# EAGLE board flex_conn_v5 (EAGLE 6.6.0), part 1 of 2
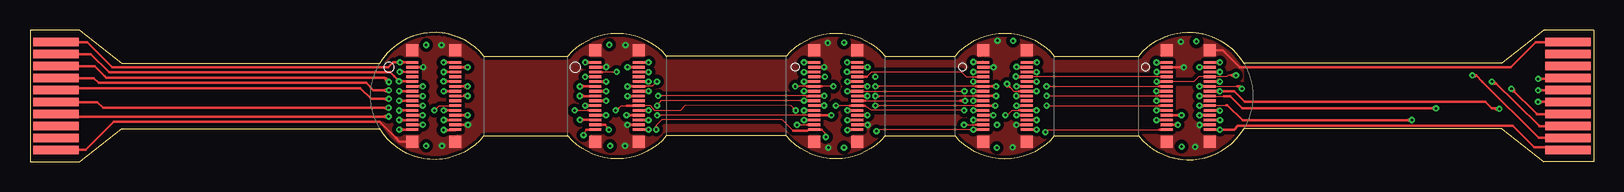
[diagram p1: board, top side]
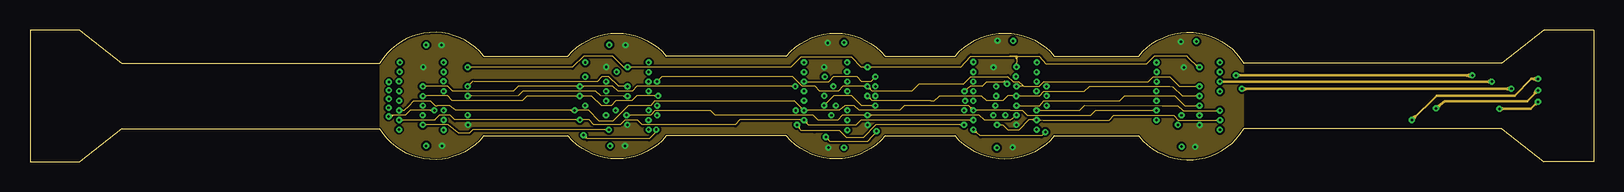
[diagram p2: board, inner layer Route2]
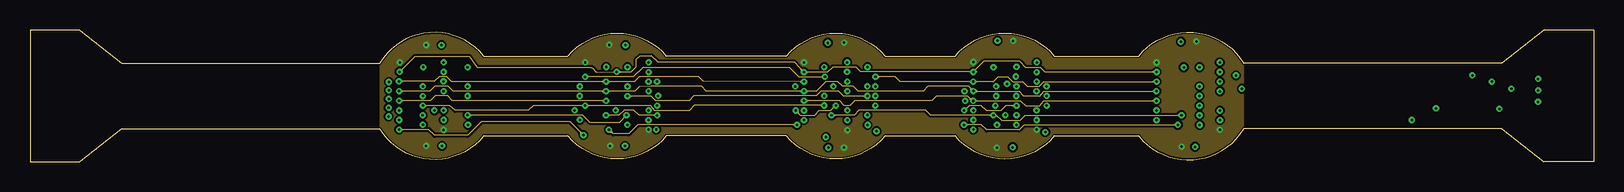
[diagram p3: board, inner layer Route15]
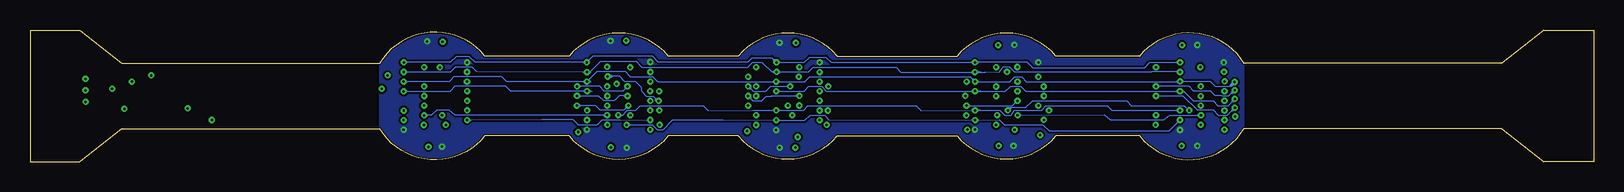
[diagram p4: board, bottom side, seen from below]

Size 130.3 x 11 mm. Coordinates in mm from the lower left corner, seen from the top.
Outline: 126.15,0 130.3,0 130.3,11 126.15,11 122.65,8.23 101.15,8.23 arc110 92.39,8.83 85.37,8.83 arc100 77.1,8.83 71.26,8.83 arc100 63.04,8.83 53.04,8.83 arc100 44.81,8.83 37.81,8.83 arc110 29.15,8.23 7.65,8.23 4.15,11 0,11 0,0 4.15,0 7.65,2.77 29.15,2.77 arc110 37.81,2.17 44.81,2.17 arc100 53.04,2.17 63.04,2.17 arc100 71.26,2.17 77.1,2.17 arc100 85.37,2.17 92.39,2.17 arc110 101.15,2.77 122.65,2.77 126.15,0
Copper layers (1*2*15*16): Top 0.035mm / dielectric 0.2mm / Route2 0.035mm / dielectric 0.2mm / Route15 0.035mm / dielectric 0.2mm / Bottom 0.035mm
Design rules "default": minimum track width 0.1mm, minimum drill 8mil, track to track 3.5mil, track to pad 3.5mil, pad to pad 3.5mil, via to via 3.5mil, smd to smd 0mil, copper to edge 0.15mm, drill to drill 0.25mm, minimum pad ring 6mil, minimum via ring 6mil, stop-mask expansion 1.5mil, vias tented up to drill 25mil, thermal gap 10mil

## Footprints (pad centres in the part's own frame; a part is rotated, then mirrored left to right if it is on the bottom)
500913-0302_REC_30CONN_2 = smd 1 x 0.22: P$1 -1.8,2.8; P$2 -1.8,2.4; P$3 -1.8,2; P$4 -1.8,1.6; P$5 -1.8,1.2; P$6 -1.8,0.8; P$7 -1.8,0.4; P$8 -1.8,0; P$9 -1.8,-0.4; P$10 -1.8,-0.8; P$11 -1.8,-1.2; P$12 -1.8,-1.6; P$13 -1.8,-2; P$14 -1.8,-2.4; P$15 -1.8,-2.8; P$16 1.8,-2.8; P$17 1.8,-2.4; P$18 1.8,-2; P$19 1.8,-1.6; P$20 1.8,-1.2; P$21 1.8,-0.8; P$22 1.8,-0.4; P$23 1.8,0; P$24 1.8,0.4; P$25 1.8,0.8; P$26 1.8,1.2; P$27 1.8,1.6; P$28 1.8,2; P$29 1.8,2.4; P$30 1.8,2.8 | smd 1 x 1: P$31 1.8,3.8; P$32 -1.8,3.8; P$33 -1.8,-3.8; P$34 1.8,-3.8
FPC_FFC = smd 3.8 x 0.7: P$1 0,4.5; P$2 0,3.5; P$3 0,2.5; P$4 0,1.5; P$5 0,0.5; P$6 0,-0.5; P$7 0,-1.5; P$8 0,-2.5; P$9 0,-3.5; P$10 0,-4.5

## Placement (x,y rotation side)
U$1  500913-0302_REC_30CONN_2  [500913-0302_REC_30CONN_2]  81.24,5.5 0 top
U$2  500913-0302_REC_30CONN_2  [500913-0302_REC_30CONN_2]  48.91,5.5 0 top
U$3  500913-0302_REC_30CONN_2  [500913-0302_REC_30CONN_2]  33.66,5.5 0 top
U$4  500913-0302_REC_30CONN_2  [500913-0302_REC_30CONN_2]  96.51,5.5 0 top
U$5  CABLE_ADAPTATOR  [FPC_FFC]  2.15,5.5 0 top
U$6  500913-0302_REC_30CONN_2  [500913-0302_REC_30CONN_2]  67.15,5.5 0 top
U$7  CABLE_ADAPTATOR  [FPC_FFC]  128.15,5.5 0 top

## Tracks (layer width: path | path; a pad name or v marks a point on that pad's centre or on a via)
/CS_0
  Top 0.1: 69.73,7.1 70.15,7.51 77.61,7.51 78.01,7.11 U$1.P$4
  Top 0.18: 78.8,7.1 79.04,7.1
  Top 0.2: U$6.P$27 69.73,7.1 | 79.04,7.1 U$1.P$4
/CS_1  (via drill 0.2)
  Top 0.1: 94.73,7.11 U$4.P$4 83.04,7.1 83.01,7.11 | U$6.P$22 68.97,5.08 68.97,5.1 v77.92,5.1 | 82.55,7.1 82.19,7.1 v82.16,7.13
  Top 0.15: 77.5,5.12 77.84,5.25 77.89,5.25 77.9,4.99 | 77.9,4.99 77.87,4.92 77.5,5.09 | 77.9,4.99 77.9,5.08 v77.92,5.1
  Top 0.2: 83.01,7.11 82.14,7.11 v82.16,7.13 v82.16,7.14 82.16,7.25 82.52,7.11 | 69.59,5.09 U$6.P$22 | 82.19,6.98 82.55,7.1
  Bottom 0.1: v77.92,5.1 77.98,5.09 78.38,5.5 78.94,5.5 79.37,5.92 79.37,6.24 79.82,6.7 80.72,6.7 81.15,7.13 v82.16,7.13 | 81.79,7.15 81.79,7.14 | 78.14,5.24 78.06,5.24 v77.92,5.1 | 77.9,5.25 77.9,5.12 v77.92,5.1
  Bottom 0.15: 81.79,7.15 82.1,7.29 82.1,7.18 82.14,7.14 82.14,7.08 82.1,7.04 82.1,7.06 v82.16,7.13 | 78.03,5.05 78.09,5.03 | 78.09,5.03 78.14,5.24 | 77.98,5.09 78.08,5.09 78.09,5.03 | 81.79,7.14 82.1,6.96 | 77.92,5.28 78.14,5.24 | 77.9,5.25 78.06,4.99
/CS_2  (via drill 0.2)
  Top 0.1: v66.24,7.1 U$6.P$4 | U$2.P$4 v46.27,7.09
  Route15 0.1: v66.24,7.1 v66.23,7.1 64.07,7.1 63.28,7.89 51.09,7.89 50.29,7.09 v46.27,7.09 v46.26,7.09
/RST_BUS  (via drill 0.2 pad 0.51)
  Top 0.1: U$1.P$21 82.79,4.7 | v82.21,4.7 | 68.7,4.7 U$6.P$21 68.71,4.7 | 69.57,4.7 70.15,4.3 v77.85,4.3 | v63.81,4.29 63.44,4.7 54.6,4.72 54.19,4.29 52.07,4.29 | 68.31,4.7 v67.15,4.7 | 77.71,4.15 77.55,4.3 | v77.85,4.3 77.71,4.15 | 77.71,4.45 77.55,4.3 | v77.85,4.3 77.71,4.45 | 77.71,4.15 77.55,4.3 | v77.85,4.3 77.71,4.15 | 77.71,4.45 77.55,4.3 | v77.85,4.3 77.71,4.45 | 77.55,4.3 77.71,4.15 v77.85,4.3 | 77.71,4.45 77.55,4.3 | v77.85,4.3 77.71,4.45 | 67.29,4.85 67.46,4.7 | v67.15,4.7 67.29,4.85 | 67.29,4.55 67.46,4.7 | v67.15,4.7 67.29,4.55 | 67.46,4.7 67.29,4.85 v67.15,4.7 | 67.29,4.55 67.46,4.7 | v67.15,4.7 67.29,4.55 | 67.29,4.85 67.46,4.7 | v67.15,4.7 67.29,4.85 | 67.46,4.7 67.29,4.55 v67.15,4.7 | 63.61,4.52 63.83,4.5 v63.81,4.29 | 63.61,4.52 63.61,4.29 v63.81,4.29 | 63.61,4.52 63.83,4.5 v63.81,4.29 | U$3.P$21 U$3.P$21 arc90 U$3.P$21 34.35,4.7 34.1,4.7 v33.7,4.3 | 48.8,4.49 49.09,4.51 49,4.25 v48.8,4.3 | v48.8,4.3 48.8,4.5 | v48.8,4.3 v48.81,4.3 48.87,4.3 49.08,4.51 49.26,4.69 49.74,4.69 | 29.45,3.72 29.84,3.59 v29.88,3.79 | v29.88,3.79 29.85,3.99 29.46,3.85 29.46,3.74 | v29.88,3.79 | v97.46,4.7 v97.46,4.69 | 33.7,4.5 33.89,4.49 33.9,4.33 v33.7,4.3 | v33.7,4.3 33.7,4.5 | v33.7,4.3 | v33.7,4.3 | U$4.P$21 98.31,4.75 99.69,4.75
  Top 0.102: U$2.P$21 51.74,4.7 52.07,4.29
  Top 0.2: v82.21,4.7 U$1.P$21 | 69.57,4.7 68.7,4.7 | 68.71,4.7 68.31,4.7 | v97.46,4.69 U$4.P$21 | v97.46,4.69 97.53,4.83 97.76,4.7 97.53,4.56 v97.46,4.69 | U$5.P$7 2.16,3.99 2.25,4.07 2.25,3.79 v29.88,3.79 | U$2.P$21 50.7,4.69 49.74,4.69 | U$7.P$4 128.07,6.92 v125.68,6.92 125.69,6.93 125.69,7.08 126.04,6.92 125.7,6.76 | v115.15,3.5 101.08,3.46 101.07,3.47 99.79,4.75 99.69,4.75 | 114.76,3.49 115.09,3.64 115.05,3.56 v115.15,3.5 | 115.14,3.35 114.76,3.49 115.14,3.49 v115.15,3.5 | 82.29,4.83 82.52,4.7 82.29,4.56 v82.21,4.7 82.29,4.83
  Route2 0.1: 96.25,4.7 95.41,5.5 91.22,5.51 90.79,5.11 84.48,5.11 84.14,4.7 v82.21,4.7 | 82.35,4.85 82.52,4.7 | v82.21,4.7 82.35,4.85 | 82.35,4.85 82.52,4.7 | v82.21,4.7 82.35,4.85 | 82.52,4.7 82.35,4.55 v82.21,4.7 | 30.23,3.84 29.98,3.61 29.9,3.75 | 29.9,3.75 29.91,4 30.23,3.87 29.91,3.78 | 29.9,3.75 29.88,3.77 v29.88,3.79 29.98,3.89 31.26,3.89 31.67,4.3 v33.7,4.3 | 33.37,4.31 33.59,4.47 v33.7,4.3 | v33.7,4.3 33.65,4.1 33.37,4.3 | v33.7,4.3 | v33.7,4.3
  Route2 0.102: 96.25,4.7 96.26,4.69 v97.46,4.69 | 97.32,4.54 97.15,4.69 | 97.32,4.85 97.15,4.69 | 97.15,4.69 97.32,4.54 v97.46,4.69 | 97.32,4.85 97.15,4.69 | v97.46,4.69 97.32,4.85 | 97.32,4.54 97.15,4.69 | v97.46,4.69 97.32,4.54 | 97.15,4.69 97.32,4.85 v97.46,4.69
  Route2 0.2: v115.15,3.5 117.22,5.54 123.74,5.54 125.12,6.92 v125.68,6.92 | 115.46,3.8 115.08,3.64 115.08,3.53 v115.15,3.5 | 125.32,6.93 125.62,7.07 125.62,6.98 v125.68,6.92 | 125.33,6.9 125.65,6.77 125.65,6.9 v125.68,6.92 | 115.29,3.44 115.45,3.8 v115.15,3.5
  Route15 0.1: v82.21,4.7 82.19,4.7 | v82.21,4.7 81.94,4.69 81.33,4.69 80.94,4.3 79.68,4.3 79.28,4.7 79.27,4.7 78.27,4.7 77.85,4.28 v77.85,4.3 | v63.81,4.29 64.19,3.9 65.38,3.9 65.79,4.3 66.75,4.3 v67.15,4.7 | v82.21,4.7 82.09,4.53 81.91,4.66 82.06,4.83 v82.21,4.7 | v77.85,4.3 77.85,4.5 78.07,4.51 78.05,4.28 v77.85,4.3 | 67.12,4.5 66.9,4.53 | v67.15,4.7 67.12,4.5 | 67.12,4.5 66.9,4.53 | v67.15,4.7 67.12,4.5 | 66.9,4.53 66.95,4.75 v67.15,4.7 | 64.02,4.3 64.02,4.07 | 63.8,4.09 64.02,4.07 | 64.02,4.3 64.02,4.07 | v63.81,4.29 64.02,4.3 | 63.8,4.09 64.02,4.07 | v63.81,4.29 63.8,4.09 | 64.02,4.3 64.02,4.07 | v63.81,4.29 64.02,4.3 | 63.8,4.09 64.02,4.07 | v63.81,4.29 63.8,4.09
  Bottom 0.1: v33.7,4.3 34.1,4.7 38.52,4.7 38.91,5.1 42.06,5.1 46.75,5.1 47.35,4.5 48.45,4.5 48.61,4.5 v48.81,4.3 v48.8,4.3 48.8,4.5 | 48.59,4.47 48.61,4.26 v48.8,4.29 48.8,4.5 | 48.8,4.5 48.58,4.5
GND  (via drill 0.2)
  Top 0.1: U$2.P$32 47.46,8.84 | U$3.P$17 35.53,3.09 | U$6.P$2 65.36,7.91 | U$4.P$2 94.74,7.88
  Top 0.2: U$3.P$2 32.73,7.9 v32.77,7.9 | 35.53,3.09 v36.5,3.09 | U$2.P$17 v49.79,3.09 | v69.8,3.08 U$6.P$17 | 65.36,7.91 v66.18,7.9 | U$1.P$2 79.45,7.89 v80.29,7.89 | U$1.P$17 v82.19,3.09 | U$4.P$17 98.3,3.08 v97.47,3.08 | U$4.P$2 v96.15,7.9 v96.15,7.89 | U$2.P$2 48,7.9 arc90 v48.02,7.92 | 32.7,7.77 32.47,7.9 | v32.77,7.9 32.7,7.77 | 32.7,8.03 32.47,7.9 | v32.77,7.9 32.7,8.03 | 36.42,2.96 36.19,3.09 | v36.5,3.09 36.42,2.96 | 36.42,3.22 36.19,3.09 | v36.5,3.09 36.42,3.22 | 47.95,7.78 47.72,7.9 | v48.02,7.92 47.95,7.78 | 47.94,8.05 47.72,7.9 | v48.02,7.92 47.94,8.05 | 49.86,3.23 50.09,3.09 | v49.79,3.09 49.86,3.23 | 49.86,2.96 50.09,3.09 | v49.79,3.09 49.86,2.96 | 69.72,2.95 69.49,3.09 | v69.8,3.08 69.72,2.95 | 69.72,3.22 69.49,3.09 | v69.8,3.08 69.72,3.22 | 66.1,7.77 65.88,7.9 | v66.18,7.9 66.1,7.77 | 66.11,8.03 65.88,7.9 | v66.18,7.9 66.11,8.03 | 80.21,7.76 79.99,7.89 | v80.29,7.89 80.21,7.76 | 80.21,8.02 79.99,7.89 | v80.29,7.89 80.21,8.02 | 82.27,3.23 82.5,3.09 | v82.19,3.09 82.27,3.23 | 82.27,2.96 82.5,3.09 | v82.19,3.09 82.27,2.96 | 96.07,7.76 95.84,7.9 | v96.15,7.89 96.07,7.76 | 96.08,8.03 95.84,7.9 | v96.15,7.89 96.08,8.03 | 97.55,3.22 97.78,3.08 | v97.47,3.08 97.55,3.22 | 97.55,2.95 97.78,3.08 | v97.47,3.08 97.55,2.95 | 32.7,7.77 32.47,7.9 | v32.77,7.9 32.7,7.77 | 32.7,8.03 32.47,7.9 | v32.77,7.9 32.7,8.03 | 32.7,7.77 32.47,7.9 | v32.77,7.9 32.7,7.77 | 32.7,8.03 32.47,7.9 | v32.77,7.9 32.7,8.03 | 32.7,7.77 32.47,7.9 | v32.77,7.9 32.7,7.77 | 32.7,8.03 32.47,7.9 | v32.77,7.9 32.7,8.03 | 36.42,2.96 36.19,3.09 | v36.5,3.09 36.42,2.96 | 36.42,3.22 36.19,3.09 | v36.5,3.09 36.42,3.22 | 36.42,2.96 36.19,3.09 | v36.5,3.09 36.42,2.96 | 36.42,3.22 36.19,3.09 | v36.5,3.09 36.42,3.22 | 36.42,2.96 36.19,3.09
  Top 0.2: v36.5,3.09 36.42,2.96 | 36.42,3.22 36.19,3.09 | v36.5,3.09 36.42,3.22 | 47.95,7.78 47.72,7.9 | v48.02,7.92 47.95,7.78 | 47.94,8.05 47.72,7.9 | v48.02,7.92 47.94,8.05 | 47.95,7.78 47.72,7.9 | v48.02,7.92 47.95,7.78 | 47.94,8.05 47.72,7.9 | v48.02,7.92 47.94,8.05 | 47.95,7.78 47.72,7.9 | v48.02,7.92 47.95,7.78 | 47.94,8.05 47.72,7.9 | v48.02,7.92 47.94,8.05 | 49.86,3.23 50.09,3.09 | v49.79,3.09 49.86,3.23 | 49.86,2.96 50.09,3.09 | v49.79,3.09 49.86,2.96 | 49.86,3.23 50.09,3.09 | v49.79,3.09 49.86,3.23 | 49.86,2.96 50.09,3.09 | v49.79,3.09 49.86,2.96 | 49.86,3.23 50.09,3.09 | v49.79,3.09 49.86,3.23 | 49.86,2.96 50.09,3.09 | v49.79,3.09 49.86,2.96 | 69.72,2.95 69.49,3.09 | v69.8,3.08 69.72,2.95 | 69.72,3.22 69.49,3.09 | v69.8,3.08 69.72,3.22 | 69.72,2.95 69.49,3.09 | v69.8,3.08 69.72,2.95 | 69.72,3.22 69.49,3.09 | v69.8,3.08 69.72,3.22 | 69.72,2.95 69.49,3.09 | v69.8,3.08 69.72,2.95 | 69.72,3.22 69.49,3.09 | v69.8,3.08 69.72,3.22 | 66.1,7.77 65.88,7.9 | v66.18,7.9 66.1,7.77 | 66.11,8.03 65.88,7.9 | v66.18,7.9 66.11,8.03 | 66.1,7.77 65.88,7.9 | v66.18,7.9 66.1,7.77 | 66.11,8.03 65.88,7.9 | v66.18,7.9 66.11,8.03 | 66.1,7.77 65.88,7.9 | v66.18,7.9 66.1,7.77 | 66.11,8.03 65.88,7.9 | v66.18,7.9 66.11,8.03 | 80.21,7.76 79.99,7.89 | v80.29,7.89 80.21,7.76 | 80.21,8.02 79.99,7.89 | v80.29,7.89 80.21,8.02 | 80.21,7.76 79.99,7.89 | v80.29,7.89 80.21,7.76 | 80.21,8.02 79.99,7.89 | v80.29,7.89 80.21,8.02 | 80.21,7.76 79.99,7.89 | v80.29,7.89 80.21,7.76 | 80.21,8.02 79.99,7.89 | v80.29,7.89 80.21,8.02 | 82.27,3.23 82.5,3.09 | v82.19,3.09 82.27,3.23 | 82.27,2.96 82.5,3.09 | v82.19,3.09 82.27,2.96 | 82.27,3.23 82.5,3.09 | v82.19,3.09 82.27,3.23 | 82.27,2.96 82.5,3.09 | v82.19,3.09 82.27,2.96 | 82.27,3.23 82.5,3.09
  Top 0.2: v82.19,3.09 82.27,3.23 | 82.27,2.96 82.5,3.09 | v82.19,3.09 82.27,2.96 | 96.07,7.76 95.84,7.9 | v96.15,7.89 96.07,7.76 | 96.08,8.03 95.84,7.9 | v96.15,7.89 96.08,8.03 | 96.07,7.76 95.84,7.9 | v96.15,7.89 96.07,7.76 | 96.08,8.03 95.84,7.9 | v96.15,7.89 96.08,8.03 | 96.07,7.76 95.84,7.9 | v96.15,7.89 96.07,7.76 | 96.08,8.03 95.84,7.9 | v96.15,7.89 96.08,8.03 | 97.55,3.22 97.78,3.08 | v97.47,3.08 97.55,3.22 | 97.55,2.95 97.78,3.08 | v97.47,3.08 97.55,2.95 | 97.55,3.22 97.78,3.08 | v97.47,3.08 97.55,3.22 | 97.55,2.95 97.78,3.08 | v97.47,3.08 97.55,2.95 | 97.55,3.22 97.78,3.08 | v97.47,3.08 97.55,3.22 | 97.55,2.95 97.78,3.08 | v97.47,3.08 97.55,2.95 | U$5.P$10 4.65,1 6.99,3.34 7.45,3.34 29.15,3.34 30.48,2.01 30.79,1.7 U$3.P$33 | 98.44,1.83 U$4.P$34 | U$7.P$1 125.47,10 123.38,7.91 100.8,7.91 99.51,9.2 99.41,9.3 U$4.P$31
  other vias: 81.89,1.22 80.62,10.11 66.52,1.2 66.48,9.93 49.63,9.74 49.58,1.34 34.33,1.34 34.29,9.74 97.09,1.26 95.91,10.02
  pour Top (isolate 0.3, no thermals): 29.15,11.33 29.15,0.03 101.15,0.03 101.15,11.33
  pour Route2 (isolate 0.15, no thermals): 29.15,11.33 29.15,0.03 101.15,0.03 101.15,11.33
P1_0_ENABLE_N  (via drill 0.2 pad 0.51)
  Top 0.1: U$6.P$14 | v77.83,3.1 U$1.P$14 | 77.97,2.95 78.14,3.1 | v77.83,3.1 77.97,2.95 | 78.14,3.1 77.97,3.25 v77.83,3.1 | 77.97,2.95 78.14,3.1 | v77.83,3.1 77.97,2.95 | v32.74,3.1
  Top 0.102: v63.92,3.1 64.77,3.1 | v48.24,2.69 47.93,3.1 | 32.11,3.1 U$3.P$14 | 64.05,3.25 64.22,3.1 | v63.92,3.1 64.05,3.25 | 64.05,2.95 64.22,3.1 | v63.92,3.1 64.05,2.95 | 64.05,3.25 64.22,3.1 | v63.92,3.1 64.05,3.25 | 64.05,2.95 64.22,3.1 | v63.92,3.1 64.05,2.95 | 48.04,2.7 48.06,2.93 | v48.24,2.69 48.04,2.7 | 48.28,2.89 48.06,2.93 | v48.24,2.69 48.28,2.89 | 48.04,2.7 48.06,2.93 | v48.24,2.69 48.04,2.7 | 48.28,2.89 48.06,2.93 | v48.24,2.69 48.28,2.89
  Top 0.2: v95.65,3.1 94.69,3.1 U$4.P$14 | v32.74,3.1 32.11,3.1 | 47.93,3.1 U$2.P$14 | 64.77,3.1 U$6.P$14 | 78.83,3.09 79.36,3.1 arc-90 79.36,3.1 U$1.P$14 | 95.57,2.97 95.35,3.1 | v95.65,3.1 95.57,2.97 | 95.57,3.23 95.35,3.1 | v95.65,3.1 95.57,3.23 | 95.57,2.97 95.35,3.1 | v95.65,3.1 95.57,2.97 | 95.57,3.23 95.35,3.1 | v95.65,3.1 95.57,3.23 | 95.57,2.97 95.35,3.1 | v95.65,3.1 95.57,2.97 | 95.57,3.23 95.35,3.1 | v95.65,3.1 95.57,3.23 | v32.74,3.1 32.66,2.97 32.43,3.1 32.66,3.24 v32.74,3.1
  Route2 0.1: 37.19,2.69 36.92,2.69 36.62,2.4 35.74,2.4 34.84,3.1 v32.74,3.1 | 46.96,2.69 arc-90 46.97,2.7 v48.24,2.69 | 66.47,2.62 67.48,2.62 68.07,2.03 69.42,2.03 70.48,3.1 v77.83,3.1 | 77.7,2.95 77.53,3.1 | v77.83,3.1 77.7,2.95 | 77.7,3.25 77.53,3.1 | v77.83,3.1 77.7,3.25 | 77.7,2.95 77.53,3.1 | v77.83,3.1 77.7,2.95 | 77.7,3.25 77.53,3.1 | v77.83,3.1 77.7,3.25 | 77.7,2.95 77.53,3.1 | v77.83,3.1 77.7,2.95 | 77.7,3.25 77.53,3.1 | v77.83,3.1 77.7,3.25 | v48.24,2.69 48.11,2.54 47.94,2.69 48.11,2.84 v48.24,2.69 | 32.87,3.25 33.04,3.1 32.87,2.95 | v32.74,3.1 32.87,3.25 | v32.74,3.1 32.87,2.95 | 32.87,3.25 33.04,3.1 | v32.74,3.1 32.87,3.25 | 32.87,2.95 33.04,3.1 | v32.74,3.1 32.87,2.95 | 32.87,3.25 33.04,3.1 | v32.74,3.1 32.87,3.25 | 32.87,2.95 33.04,3.1 | v32.74,3.1 32.87,2.95
  Route2 0.102: 66.47,2.62 65.36,2.6 64.27,2.62 v63.92,3.1 | 46.96,2.69 37.19,2.69 | 64.12,3.08 64.1,2.85 63.88,2.9 | 64.12,3.08 64.1,2.86 63.88,2.9 | v63.92,3.1 64.12,3.08 | v63.92,3.1 63.88,2.9 | 64.12,3.08 64.1,2.86 63.88,2.9 | v63.92,3.1 64.12,3.08 | v63.92,3.1 63.88,2.9
  Route15 0.1: v63.92,3.1 50.63,3.1 49.88,2.34 48.59,2.34 v48.24,2.69 | 78.57,3.1 79.27,3.1 79.71,2.68 82.42,2.68 82.44,2.69 | 63.78,2.95 63.61,3.1 | v63.92,3.1 63.78,2.95 | 63.78,3.25 63.61,3.1 | v63.92,3.1 63.78,3.25 | 63.61,3.1 63.78,2.95 v63.92,3.1 | 63.78,3.25 63.61,3.1 | v63.92,3.1 63.78,3.25 | 63.78,2.95 63.61,3.1 | v63.92,3.1 63.78,2.95 | 63.78,3.25 63.61,3.1 | v63.92,3.1 63.78,3.25 | 48.45,2.7 48.46,2.47 | 48.23,2.48 48.46,2.47 | 48.45,2.7 48.46,2.47 | v48.24,2.69 48.45,2.7 | 48.23,2.48 48.46,2.47 | v48.24,2.69 48.23,2.48 | 48.45,2.7 48.46,2.47 | v48.24,2.69 48.45,2.7 | 48.23,2.48 48.46,2.47 | v48.24,2.69 48.23,2.48
  Route15 0.102: v95.65,3.1 95.56,3.08 82.84,3.09 82.44,2.69 | 78.57,3.1 v77.83,3.1 | v77.83,3.1 77.97,3.25 78.14,3.1 77.97,2.95 v77.83,3.1 | 95.51,3.24 95.35,3.09 | v95.65,3.1 95.51,3.24 | 95.35,3.09 95.52,2.94 v95.65,3.1 | 95.51,3.24 95.35,3.09 | v95.65,3.1 95.51,3.24
P1_2_TA0_1  (via drill 0.2 pad 0.51)
  Top 0.1: 68.94,3.49 U$6.P$18
  Top 0.102: 50.47,3.51 U$2.P$18 | U$1.P$18 83.4,3.5 | U$6.P$18 68.71,3.49
  Top 0.2: U$4.P$18 98.89,3.49 v99.16,3.49 | v51.54,3.49 50.47,3.51 | 83.4,3.5 v83.88,3.5 | v34.47,3.5 U$3.P$18 | v68.11,3.49 68.94,3.49 | 99.08,3.63 98.86,3.49 | v99.16,3.49 99.08,3.63 | 98.86,3.49 99.09,3.36 v99.16,3.49 | 99.08,3.63 98.86,3.49 | v99.16,3.49 99.08,3.63 | 68.19,3.62 68.42,3.49 | v68.11,3.49 68.19,3.62 | 68.19,3.35 68.42,3.49 | v68.11,3.49 68.19,3.35 | 68.19,3.62 68.42,3.49 | v68.11,3.49 68.19,3.62 | 68.19,3.35 68.42,3.49 | v68.11,3.49 68.19,3.35 | 68.19,3.62 68.42,3.49 | v68.11,3.49 68.19,3.62 | 68.19,3.35 68.42,3.49 | v68.11,3.49 68.19,3.35 | 51.46,3.63 51.23,3.5 | v51.54,3.49 51.46,3.63 | 51.23,3.5 51.46,3.36 v51.54,3.49 | 51.46,3.63 51.23,3.5 | v51.54,3.49 51.46,3.63 | v83.88,3.5 83.81,3.37 83.58,3.5 83.81,3.63 v83.88,3.5 | 34.55,3.63 34.77,3.5 | v34.47,3.5 34.55,3.63 | 34.55,3.37 34.77,3.5 | v34.47,3.5 34.55,3.37 | 34.55,3.63 34.77,3.5 | v34.47,3.5 34.55,3.63 | 34.55,3.37 34.77,3.5 | v34.47,3.5 34.55,3.37 | 34.55,3.63 34.77,3.5 | v34.47,3.5 34.55,3.63 | 34.55,3.37 34.77,3.5 | v34.47,3.5 34.55,3.37
  Route2 0.1: v83.88,3.5 83.75,3.35 83.58,3.5 83.75,3.65 v83.88,3.5 | 80.89,3.09 80.72,3.25 v80.58,3.1 | 80.89,3.09 80.72,2.94 v80.58,3.1 | 80.89,3.09 80.72,3.25 v80.58,3.1 | 80.89,3.09 80.72,2.94 v80.58,3.1 | v83.88,3.5 83.24,3.5 82.44,2.69 81.48,2.69 81.07,3.1 v80.58,3.1 | 95.3,3.89 95.69,3.49 99.02,3.49 99.03,3.48
  Route2 0.102: 99.03,3.48 v99.16,3.49 | v83.88,3.5 84.44,3.49 89.94,3.49 90.3,3.9 95.16,3.89 95.3,3.89 | 99.03,3.34 98.86,3.48 | v99.16,3.49 99.03,3.34 | 99.02,3.64 98.86,3.48 | v99.16,3.49 99.02,3.64 | 99.03,3.34 98.86,3.48 | v99.16,3.49 99.03,3.34 | 99.02,3.64 98.86,3.48 | v99.16,3.49 99.02,3.64 | 84.02,3.65 84.19,3.5 | v83.88,3.5 84.02,3.65 | 84.02,3.35 84.19,3.5 | v83.88,3.5 84.02,3.35 | 84.02,3.65 84.19,3.5 | v83.88,3.5 84.02,3.65 | 84.02,3.35 84.19,3.5 | v83.88,3.5 84.02,3.35
  Bottom 0.1: 49.11,3.1 49.54,3.5 v51.54,3.49 | v51.54,3.49 v51.53,3.49 63.74,3.5 | v34.47,3.5 35.38,2.59 45.38,2.59 45.9,3.11 | v68.11,3.49 68.28,3.48 72.51,3.5 76.74,3.5 77.55,2.7 78.02,2.7 78.43,3.09 78.43,3.1 v80.58,3.1 | 68.25,3.64 68.42,3.48 | v68.11,3.49 68.25,3.64 | 68.42,3.48 68.25,3.33 v68.11,3.49 | 68.25,3.64 68.42,3.48 | v68.11,3.49 68.25,3.64 | 68.42,3.48 68.25,3.33 v68.11,3.49 | 51.4,3.34 51.23,3.5 | v51.54,3.49 51.4,3.34 | 51.4,3.34 51.23,3.5 | v51.54,3.49 51.4,3.34 | 51.23,3.5 51.4,3.65 v51.54,3.49 | v51.54,3.49 51.68,3.65 51.84,3.49 51.67,3.34 v51.54,3.49 | 80.45,2.95 80.28,3.1 | v80.58,3.1 80.45,2.95 | 80.45,3.25 80.28,3.1 | v80.58,3.1 80.45,3.25 | 80.45,2.95 80.28,3.1 | v80.58,3.1 80.45,2.95 | 80.45,3.25 80.28,3.1 | v80.58,3.1 80.45,3.25 | 80.45,2.95 80.28,3.1 80.45,3.25 | v80.58,3.1 80.45,2.95 | v80.58,3.1 80.45,3.25 | 34.67,3.51 34.68,3.28 | 34.46,3.3 34.68,3.28 | 34.67,3.51 34.68,3.28 | v34.47,3.5 34.67,3.51 | 34.46,3.3 34.68,3.28 | v34.47,3.5 34.46,3.3 | 34.67,3.51 34.68,3.28 | v34.47,3.5 34.67,3.51 | 34.46,3.3 34.68,3.28 | v34.47,3.5 34.46,3.3
  Bottom 0.102: v68.11,3.49 65.74,3.47 65.28,3.89 64.09,3.9 63.74,3.5 | 49.11,3.1 45.9,3.11 | 67.81,3.48 67.98,3.33 v68.11,3.49 | 67.98,3.64 67.81,3.48 | v68.11,3.49 67.98,3.64 | 67.81,3.48 67.98,3.33 v68.11,3.49 | 67.98,3.64 67.81,3.48 | v68.11,3.49 67.98,3.64
P1_3_TA0_2_N  (via drill 0.2 pad 0.51)
  Top 0.1: 65.59,2.7 65.36,2.7 U$6.P$15 | v46.13,2.24 46.35,2.7 | U$4.P$15 | v78.61,2.7 | v66.32,2.09 66.32,2.34 65.97,2.7 | v78.61,2.7 70.54,2.7 v70.54,2.57 | v52.19,2.7 52.18,3.05 52.64,3.51 62.69,3.51 63.6,2.6 | v78.61,2.7 78.48,2.55 78.31,2.7 78.47,2.85 v78.61,2.7 | v70.54,2.57 70.6,2.76 70.81,2.7 70.73,2.49 v70.54,2.57 | v66.32,2.09 66.15,2.2 66.28,2.39 66.45,2.24 v66.32,2.09 | 52.34,2.83 52.18,3 | v52.19,2.7 52.34,2.83 | 52.18,3 52.03,2.83 v52.19,2.7 | 52.34,2.83 52.18,3 | v52.19,2.7 52.34,2.83 | 46.05,2.43 46.26,2.51 | v46.13,2.24 46.05,2.43 | 46.32,2.29 46.26,2.51 | v46.13,2.24 46.32,2.29 | 46.05,2.43 46.26,2.51 46.32,2.29 | v46.13,2.24 46.05,2.43 | v46.13,2.24 46.32,2.29 | 46.05,2.43 46.26,2.51 | v46.13,2.24 46.05,2.43 | 46.32,2.29 46.26,2.51 | v46.13,2.24 46.32,2.29
  Top 0.102: 94.94,2.68 94.1,2.69 84.86,2.68 84.68,2.57 v84.61,2.49 | 84.62,2.69 84.85,2.68 | v84.61,2.49 84.62,2.69 | 84.81,2.45 84.85,2.68 | v84.61,2.49 84.81,2.45 | 84.62,2.69 84.85,2.68 | v84.61,2.49 84.62,2.69 | 84.81,2.45 84.85,2.68 | v84.61,2.49 84.81,2.45 | 84.85,2.68 84.62,2.69 v84.61,2.49 | 84.81,2.45 84.85,2.68 | v84.61,2.49 84.81,2.45
  Top 0.2: v30.76,2.7 31.29,2.7 U$3.P$15 | 65.36,2.7 64.89,2.7 64.79,2.6 63.6,2.6 | 46.35,2.7 U$2.P$15 | 94.1,2.69 U$4.P$15 | v78.61,2.7 U$1.P$15 | 65.97,2.7 U$6.P$15 | 70.58,2.7 arc90 70.54,2.67 v70.54,2.57 | 78.69,2.83 78.92,2.7 | v78.61,2.7 78.69,2.83 | 78.69,2.57 78.92,2.7 | v78.61,2.7 78.69,2.57 | 78.69,2.83 78.92,2.7 | v78.61,2.7 78.69,2.83 | 78.69,2.57 78.92,2.7 | v78.61,2.7 78.69,2.57 | 78.69,2.83 78.92,2.7 | v78.61,2.7 78.69,2.83 | 78.69,2.57 78.92,2.7 | v78.61,2.7 78.69,2.57 | v30.76,2.7 30.83,2.83 31.06,2.7 30.83,2.57 v30.76,2.7
  Route2 0.1: v78.61,2.7 79.19,2.18 84.31,2.18 v84.61,2.49 | v46.13,2.24 46.43,1.94 51.59,1.94 52.18,2.53 v52.19,2.7 | v70.54,2.57 69.78,1.71 66.7,1.71 v66.32,2.09 | 84.62,2.29 84.4,2.27 | 84.41,2.5 84.4,2.27 | 84.4,2.27 84.62,2.29 v84.61,2.49 | 84.41,2.5 84.4,2.27 | v84.61,2.49 84.41,2.5 | 84.62,2.29 84.4,2.27 | v84.61,2.49 84.62,2.29 | 84.41,2.5 84.4,2.27 | v84.61,2.49 84.41,2.5 | v78.61,2.7 78.81,2.72 78.84,2.5 78.61,2.5 v78.61,2.7 | v70.54,2.57 70.57,2.36 70.34,2.34 70.34,2.56 v70.54,2.57 | 66.53,2.1 66.54,1.87 | 66.31,1.88 66.54,1.87 | 66.54,1.87 66.53,2.1 v66.32,2.09 | 66.31,1.88 66.54,1.87 | v66.32,2.09 66.31,1.88 | 66.53,2.1 66.54,1.87 | v66.32,2.09 66.53,2.1 | 66.31,1.88 66.54,1.87 | v66.32,2.09 66.31,1.88 | 52.27,2.51 52.07,2.41 | v52.19,2.7 52.27,2.51 | 51.99,2.63 52.07,2.41 | v52.19,2.7 51.99,2.63 | 52.27,2.51 52.07,2.41 | v52.19,2.7 52.27,2.51 | 51.99,2.63 52.07,2.41 | 52.27,2.51 52.07,2.41 | v52.19,2.7 52.27,2.51 | 51.99,2.63 52.07,2.41 | v52.19,2.7 51.99,2.63 | 46.33,2.25 46.34,2.02 | 46.12,2.03 46.34,2.02 | 46.34,2.02 46.33,2.25 v46.13,2.24 | 46.12,2.03 46.34,2.02 | v46.13,2.24 46.12,2.03 | 46.33,2.25 46.34,2.02 46.12,2.03 | v46.13,2.24 46.33,2.25 | v46.13,2.24 46.12,2.03
  Route15 0.1: v30.76,2.7 33.24,2.7 33.71,2.23 36.47,2.23 37.6,3.36 45,3.36 v46.13,2.24 | 45.92,2.23 45.91,2.45 46.14,2.44 | 45.92,2.23 45.91,2.45 | v46.13,2.24 45.92,2.23 | 46.14,2.44 45.91,2.45 | v46.13,2.24 46.14,2.44 | 45.92,2.23 45.91,2.45 | v46.13,2.24 45.92,2.23 | 46.14,2.44 45.91,2.45 | v46.13,2.24 46.14,2.44 | v30.76,2.7 30.89,2.85 31.06,2.7 30.89,2.55 v30.76,2.7
P1_4_TA0_3  (via drill 0.2 pad 0.51)
  Top 0.1: U$1.P$19 82.77,3.88 | 35.22,3.91 U$3.P$19 | U$6.P$19 | U$4.P$19 arc90 U$4.P$19
  Top 0.102: 82.77,3.88
  Top 0.2: U$2.P$19 50,3.9 v49.71,3.9 | v36.46,3.9 35.22,3.91 | v82.21,3.9 U$1.P$19 | v69.79,3.9 U$6.P$19 | v97.46,3.89 U$4.P$19 | 97.54,4.02 97.76,3.89 | v97.46,3.89 97.54,4.02 | 97.54,3.76 97.76,3.89 | v97.46,3.89 97.54,3.76 | 82.29,4.03 82.52,3.9 | v82.21,3.9 82.29,4.03 | 82.29,3.77 82.52,3.9 | v82.21,3.9 82.29,3.77 | 69.71,3.77 69.48,3.9 | v69.79,3.9 69.71,3.77 | 69.71,4.03 69.48,3.9 | v69.79,3.9 69.71,4.03 | 49.78,4.03 50.01,3.9 | v49.71,3.9 49.78,4.03 | 49.78,3.77 50.01,3.9 | v49.71,3.9 49.78,3.77 | 36.39,3.77 36.16,3.91 | v36.46,3.9 36.39,3.77 | 36.39,4.04 36.16,3.91 | v36.46,3.9 36.39,4.04 | 97.54,4.02 97.76,3.89 | v97.46,3.89 97.54,4.02 | 97.54,3.76 97.76,3.89 | v97.46,3.89 97.54,3.76 | 97.76,3.89 97.54,4.02 v97.46,3.89 | 97.54,3.76 97.76,3.89 | v97.46,3.89 97.54,3.76 | 97.54,4.02 97.76,3.89 | v97.46,3.89 97.54,4.02 | 97.76,3.89 97.54,3.76 v97.46,3.89 | 82.29,4.03 82.52,3.9 | v82.21,3.9 82.29,4.03 | 82.29,3.77 82.52,3.9 | v82.21,3.9 82.29,3.77 | 82.29,4.03 82.52,3.9 | v82.21,3.9 82.29,4.03 | 82.29,3.77 82.52,3.9 | v82.21,3.9 82.29,3.77 | 82.29,4.03 82.52,3.9 | v82.21,3.9 82.29,4.03 | 82.29,3.77 82.52,3.9 | v82.21,3.9 82.29,3.77 | 69.71,3.77 69.48,3.9 | v69.79,3.9 69.71,3.77 | 69.71,4.03 69.48,3.9 | v69.79,3.9 69.71,4.03 | 69.71,3.77 69.48,3.9 | v69.79,3.9 69.71,3.77 | 69.71,4.03 69.48,3.9 | v69.79,3.9 69.71,4.03 | 69.71,3.77 69.48,3.9 | v69.79,3.9 69.71,3.77 | 69.71,4.03 69.48,3.9 | v69.79,3.9 69.71,4.03 | 49.78,4.03 50.01,3.9 | v49.71,3.9 49.78,4.03 | 49.78,3.77 50.01,3.9 | v49.71,3.9 49.78,3.77 | 49.78,4.03 50.01,3.9 | v49.71,3.9 49.78,4.03 | 49.78,3.77 50.01,3.9 | v49.71,3.9 49.78,3.77 | 49.78,4.03 50.01,3.9 | v49.71,3.9 49.78,4.03 | 49.78,3.77 50.01,3.9 | v49.71,3.9 49.78,3.77 | 36.39,3.77 36.16,3.91
  Top 0.2: v36.46,3.9 36.39,3.77 | 36.39,4.04 36.16,3.91 | v36.46,3.9 36.39,4.04 | 36.39,3.77 36.16,3.91 | v36.46,3.9 36.39,3.77 | 36.39,4.04 36.16,3.91 | v36.46,3.9 36.39,4.04 | 36.39,3.77 36.16,3.91 | v36.46,3.9 36.39,3.77 | 36.39,4.04 36.16,3.91 | v36.46,3.9 36.39,4.04
  Route2 0.1: v82.21,3.9 81.68,3.5 79.56,3.5 79.12,3.9 78.71,3.9 78.58,3.9 v69.79,3.9 | v49.71,3.9 51.72,3.89 52.07,4.29 56.72,4.28 57.1,3.9 | v69.79,3.9 67.7,3.9 67.32,3.49 | 82.19,3.7 81.97,3.72 | v82.21,3.9 82.19,3.7 | 82.01,3.94 81.97,3.72 | v82.21,3.9 82.01,3.94 | 69.65,3.75 69.48,3.9 | v69.79,3.9 69.65,3.75 | 69.65,4.05 69.48,3.9 | v69.79,3.9 69.65,4.05 | 69.92,4.05 70.09,3.9 | v69.79,3.9 69.92,4.05 | 69.92,3.75 70.09,3.9 | v69.79,3.9 69.92,3.75 | 49.84,4.05 50.01,3.9 | v49.71,3.9 49.84,4.05 | 49.84,3.75 50.01,3.9 | v49.71,3.9 49.84,3.75 | 82.19,3.7 81.97,3.72 | v82.21,3.9 82.19,3.7 | 82.01,3.94 81.97,3.72 | v82.21,3.9 82.01,3.94 | 82.19,3.7 81.97,3.72 | v82.21,3.9 82.19,3.7 | 82.01,3.94 81.97,3.72 | v82.21,3.9 82.01,3.94 | 82.19,3.7 81.97,3.72 | v82.21,3.9 82.19,3.7 | 82.01,3.94 81.97,3.72 | v82.21,3.9 82.01,3.94 | 69.65,3.75 69.48,3.9 | v69.79,3.9 69.65,3.75 | 69.65,4.05 69.48,3.9 | v69.79,3.9 69.65,4.05 | 69.92,4.05 70.09,3.9 | v69.79,3.9 69.92,4.05 | 69.92,3.75 70.09,3.9 | v69.79,3.9 69.92,3.75 | 69.65,3.75 69.48,3.9 | v69.79,3.9 69.65,3.75 | 69.65,4.05 69.48,3.9 | v69.79,3.9 69.65,4.05 | 69.65,3.75 69.48,3.9 | v69.79,3.9 69.65,3.75 | 69.65,4.05 69.48,3.9 | v69.79,3.9 69.65,4.05 | 69.92,4.05 70.09,3.9 | v69.79,3.9 69.92,4.05 | 69.92,3.75 70.09,3.9 | v69.79,3.9 69.92,3.75 | 69.92,4.05 70.09,3.9 | v69.79,3.9 69.92,4.05 | 69.92,3.75 70.09,3.9 | v69.79,3.9 69.92,3.75 | 49.84,4.05 50.01,3.9 | v49.71,3.9 49.84,4.05 | 49.84,3.75 50.01,3.9 | v49.71,3.9 49.84,3.75 | 49.84,4.05 50.01,3.9 | v49.71,3.9 49.84,4.05 | 49.84,3.75 50.01,3.9 | v49.71,3.9 49.84,3.75 | 49.84,4.05 50.01,3.9 | v49.71,3.9 49.84,4.05 | 49.84,3.75 50.01,3.9 | v49.71,3.9 49.84,3.75
  Route2 0.102: 57.1,3.9 63.47,3.89 65.29,3.9 65.69,3.49 67.32,3.49
  Route15 0.1: v36.46,3.9 38.17,3.9 46.08,3.9 46.7,3.29 48.95,3.29 49.09,3.29 v49.71,3.9 | 49.72,3.7 49.49,3.69 | v49.71,3.9 49.72,3.7 | 49.5,3.91 49.49,3.69 | v49.71,3.9 49.5,3.91 | 36.6,4.06 36.77,3.9 | v36.46,3.9 36.6,4.06 | 36.6,3.75 36.77,3.9 | v36.46,3.9 36.6,3.75 | 49.72,3.7 49.49,3.69 | v49.71,3.9 49.72,3.7 | 49.5,3.91 49.49,3.69 | v49.71,3.9 49.5,3.91 | 49.72,3.7 49.49,3.69 | v49.71,3.9 49.72,3.7 | 49.5,3.91 49.49,3.69 | v49.71,3.9 49.5,3.91 | 49.72,3.7 49.49,3.69 | v49.71,3.9 49.72,3.7 | 49.5,3.91 49.49,3.69 | v49.71,3.9 49.5,3.91 | 36.6,4.06 36.77,3.9 | v36.46,3.9 36.6,4.06 | 36.6,3.75 36.77,3.9 | v36.46,3.9 36.6,3.75 | 36.6,4.06 36.77,3.9 | v36.46,3.9 36.6,4.06 | 36.6,3.75 36.77,3.9 | v36.46,3.9 36.6,3.75 | 36.6,4.06 36.77,3.9 | v36.46,3.9 36.6,4.06 | 36.77,3.9 36.6,3.75 v36.46,3.9
  Bottom 0.1: v82.21,3.9 94.88,3.9 95.35,4.33 96.42,4.33 96.85,3.89 v97.46,3.89 | 97.32,3.74 97.15,3.89 | v97.46,3.89 97.32,3.74 | 97.32,4.04 97.15,3.89 | v97.46,3.89 97.32,4.04 | 82.35,4.05 82.52,3.9 | v82.21,3.9 82.35,4.05 | 82.35,3.75 82.52,3.9 | v82.21,3.9 82.35,3.75 | 97.32,3.74 97.15,3.89 | v97.46,3.89 97.32,3.74 | 97.32,4.04 97.15,3.89 | v97.46,3.89 97.32,4.04 | 97.32,3.74 97.15,3.89 | v97.46,3.89 97.32,3.74 | 97.32,4.04 97.15,3.89 | v97.46,3.89 97.32,4.04 | 97.32,3.74 97.15,3.89 | v97.46,3.89 97.32,3.74 | 97.32,4.04 97.15,3.89 | v97.46,3.89 97.32,4.04 | 82.35,4.05 82.52,3.9 | v82.21,3.9 82.35,4.05 | 82.35,3.75 82.52,3.9 | v82.21,3.9 82.35,3.75 | 82.35,4.05 82.52,3.9 | v82.21,3.9 82.35,4.05 | 82.35,3.75 82.52,3.9 | v82.21,3.9 82.35,3.75 | 82.35,4.05 82.52,3.9 82.35,3.75 | v82.21,3.9 82.35,4.05 | v82.21,3.9 82.35,3.75
P1_5_TA0_4  (via drill 0.2 pad 0.51)
  Top 0.1: v81.28,3.9 81.44,3.9 81.84,4.3 82.44,4.3 | v81.28,3.9 81.34,4.09 81.56,4.02 81.47,3.81 v81.28,3.9 | U$1.P$20 v83.88,4.3
  Top 0.2: v68.12,4.3 68.7,4.3 U$6.P$20 | v51.55,4.31 U$2.P$20 | U$3.P$20 34.63,4.31 v34.47,4.3 | 68.19,4.43 68.42,4.3 | v68.12,4.3 68.19,4.43 | 68.19,4.43 68.42,4.3 | v68.12,4.3 68.19,4.43 | 68.42,4.3 68.19,4.16 v68.12,4.3 | 51.47,4.17 51.24,4.31 | v51.55,4.31 51.47,4.17 | 51.47,4.44 51.24,4.31 | v51.55,4.31 51.47,4.44 | 51.24,4.31 51.47,4.17 v51.55,4.31 | 51.47,4.44 51.24,4.31 | v51.55,4.31 51.47,4.44 | 51.47,4.17 51.24,4.31 | v51.55,4.31 51.47,4.17 | 51.47,4.44 51.24,4.31 | v51.55,4.31 51.47,4.44 | 34.55,4.44 34.77,4.31 | v34.47,4.3 34.55,4.44 | 34.55,4.44 34.77,4.31 | v34.47,4.3 34.55,4.44 | 34.77,4.31 34.55,4.17 v34.47,4.3 | U$4.P$20 98.97,4.3 v99.16,4.29 | v83.88,4.3 82.44,4.3 | v99.16,4.29 99.07,4.16 98.85,4.3 99.08,4.42 v99.16,4.29 | v83.88,4.3 83.8,4.17 83.57,4.3 83.8,4.44 v83.88,4.3 | U$6.P$20 | 50.47,4.31 U$2.P$20 | U$2.P$20
  Route2 0.1: 96.07,4.32 95.66,4.7 94.36,4.7 87.92,4.71 87.49,4.29 84.3,4.31 v83.88,4.3 | v83.88,4.3 84.01,4.46 84.18,4.31 84.01,4.15 v83.88,4.3
  Route2 0.102: v99.16,4.29 96.11,4.29 96.07,4.32 | 99.02,4.14 98.85,4.29 | 99.02,4.44 98.85,4.29 | 99.02,4.14 98.85,4.29 | v99.16,4.29 99.02,4.14 | 99.02,4.44 98.85,4.29 | v99.16,4.29 99.02,4.44 | 99.02,4.14 98.85,4.29 | v99.16,4.29 99.02,4.14 | 99.02,4.44 98.85,4.29 | v99.16,4.29 99.02,4.44
  Bottom 0.1: v68.12,4.3 67.5,4.3 65.84,4.3 65.47,4.71 56.44,4.7 56.04,4.28 51.13,4.3 v51.55,4.31 | v68.12,4.3 70.07,4.3 73.78,4.29 74.2,4.7 79.45,4.7 79.82,4.29 80.52,4.29 80.92,3.9 v81.28,3.9 | 49.08,3.9 49.51,4.33 50.45,4.32 v51.55,4.31 | v34.47,4.3 34.48,4.3 40.15,4.31 40.54,4.7 45.64,4.69 46,4.3 46.43,4.3 | 68.25,4.45 68.42,4.3 | v68.12,4.3 68.25,4.45 | v68.12,4.3 67.98,4.15 67.81,4.3 67.98,4.45 v68.12,4.3 | 68.25,4.45 68.42,4.3 | v68.12,4.3 68.25,4.45 | 68.42,4.3 68.25,4.14 v68.12,4.3 | 81.14,4.05 80.98,3.9 | v81.28,3.9 81.14,4.05 | 80.98,3.9 81.14,3.75 v81.28,3.9 | 81.14,4.05 80.98,3.9 | v81.28,3.9 81.14,4.05 | 51.41,4.46 51.24,4.3 | v51.55,4.31 51.41,4.46 | 51.24,4.3 51.41,4.15 v51.55,4.31 | 51.41,4.46 51.24,4.3 | v51.55,4.31 51.41,4.46 | v51.55,4.31 51.41,4.16 51.24,4.31 51.41,4.46 v51.55,4.31 | v34.47,4.3 34.61,4.45 34.77,4.3 34.6,4.15 v34.47,4.3
  Bottom 0.102: 46.43,4.3 48.27,4.3 48.52,3.89 49.07,3.89 49.08,3.9
P2_7_UCA0_CLK_N  (via drill 0.2, 0.2 pad 0.51)
  Top 0.1: U$2.P$13 | U$6.P$13
  Top 0.102: U$2.P$13 47.35,3.51 | 31.44,3.5 U$3.P$13 | 94.95,3.48 U$4.P$13
  Top 0.2: v45.82,3.5 U$2.P$13 | v30.76,3.5 31.44,3.5 | v93.88,3.49 94.95,3.48 | v64.5,3.49 U$6.P$13 | v78.61,3.5 U$1.P$13 | 45.89,3.64 46.12,3.51 | v45.82,3.5 45.89,3.64 | 45.9,3.37 46.12,3.51 | v45.82,3.5 45.9,3.37 | 30.83,3.63 31.06,3.5 | v30.76,3.5 30.83,3.63 | 30.83,3.37 31.06,3.5 | v30.76,3.5 30.83,3.37 | 93.96,3.62 94.18,3.49 | v93.88,3.49 93.96,3.62 | 93.96,3.35 94.18,3.49 | v93.88,3.49 93.96,3.35 | 64.58,3.63 64.8,3.49 | v64.5,3.49 64.58,3.63 | 64.58,3.36 64.8,3.49 | v64.5,3.49 64.58,3.36 | 78.69,3.63 78.92,3.5 | v78.61,3.5 78.69,3.63 | 78.69,3.36 78.92,3.5 | v78.61,3.5 78.69,3.36 | 45.89,3.64 46.12,3.51 | v45.82,3.5 45.89,3.64 | 45.9,3.37 46.12,3.51 | v45.82,3.5 45.9,3.37 | 45.89,3.64 46.12,3.51 | v45.82,3.5 45.89,3.64 | 45.9,3.37 46.12,3.51 | v45.82,3.5 45.9,3.37 | 45.89,3.64 46.12,3.51 | v45.82,3.5 45.89,3.64 | 45.9,3.37 46.12,3.51 | v45.82,3.5 45.9,3.37 | 30.83,3.63 31.06,3.5 | v30.76,3.5 30.83,3.63 | 30.83,3.37 31.06,3.5 | v30.76,3.5 30.83,3.37 | 30.83,3.63 31.06,3.5 | v30.76,3.5 30.83,3.63 | 30.83,3.37 31.06,3.5 | v30.76,3.5 30.83,3.37 | 30.83,3.63 31.06,3.5 | v30.76,3.5 30.83,3.63 | 30.83,3.37 31.06,3.5 | v30.76,3.5 30.83,3.37 | 93.96,3.62 94.18,3.49 | v93.88,3.49 93.96,3.62 | 93.96,3.35 94.18,3.49 | v93.88,3.49 93.96,3.35 | 93.96,3.62 94.18,3.49 | v93.88,3.49 93.96,3.62 | 93.96,3.35 94.18,3.49 | v93.88,3.49 93.96,3.35 | 93.96,3.62 94.18,3.49 | v93.88,3.49 93.96,3.62 | 93.96,3.35 94.18,3.49 | v93.88,3.49 93.96,3.35 | 64.58,3.63 64.8,3.49 | v64.5,3.49 64.58,3.63 | 64.58,3.36 64.8,3.49 | v64.5,3.49 64.58,3.36 | 64.58,3.63 64.8,3.49 | v64.5,3.49 64.58,3.63 | 64.58,3.36 64.8,3.49 | v64.5,3.49 64.58,3.36 | 64.58,3.63 64.8,3.49 | v64.5,3.49 64.58,3.63 | 64.58,3.36 64.8,3.49 | v64.5,3.49 64.58,3.36
  Top 0.2: 78.69,3.63 78.92,3.5 | v78.61,3.5 78.69,3.63 | 78.69,3.36 78.92,3.5 | v78.61,3.5 78.69,3.36 | 78.69,3.63 78.92,3.5 | v78.61,3.5 78.69,3.63 | 78.69,3.36 78.92,3.5 | v78.61,3.5 78.69,3.36 | 78.69,3.63 78.92,3.5 | v78.61,3.5 78.69,3.63 | 78.69,3.36 78.92,3.5 | v78.61,3.5 78.69,3.36
  Route2 0.1: v45.82,3.5 36.7,3.5 35.4,3.5 35.01,3.9 34.11,3.9 33.73,3.5 33.72,3.5 v30.76,3.5 | v45.82,3.5 46.59,3.5 46.98,3.11 49.17,3.11 49.56,3.5 50.63,3.5 51.03,3.1 58.77,3.1 59.16,3.53 64.5,3.53 v64.5,3.49 | v78.61,3.5 69.25,3.5 68.84,3.1 68.83,3.08 68.36,3.08 65.15,3.08 64.91,3.08 v64.5,3.49 | 45.68,3.35 45.51,3.5 | v45.82,3.5 45.68,3.35 | 45.68,3.66 45.51,3.5 | v45.82,3.5 45.68,3.66 | 45.95,3.66 46.12,3.5 | v45.82,3.5 45.95,3.66 | 45.95,3.35 46.12,3.5 | v45.82,3.5 45.95,3.35 | 30.89,3.65 31.06,3.5 | v30.76,3.5 30.89,3.65 | 30.89,3.35 31.06,3.5 | v30.76,3.5 30.89,3.35 | 64.35,3.36 64.2,3.53 | v64.5,3.49 64.35,3.36 | 64.38,3.66 64.2,3.53 | v64.5,3.49 64.38,3.66 | 64.7,3.51 64.72,3.28 | v64.5,3.49 64.7,3.51 | 64.49,3.29 64.72,3.28 | v64.5,3.49 64.49,3.29 | 78.47,3.34 78.31,3.5 | v78.61,3.5 78.47,3.34 | 78.47,3.65 78.31,3.5 | v78.61,3.5 78.47,3.65 | 45.68,3.35 45.51,3.5 | v45.82,3.5 45.68,3.35 | 45.68,3.66 45.51,3.5 | v45.82,3.5 45.68,3.66 | 45.95,3.66 46.12,3.5 | v45.82,3.5 45.95,3.66 | 45.95,3.35 46.12,3.5 | v45.82,3.5 45.95,3.35 | 45.68,3.35 45.51,3.5 | v45.82,3.5 45.68,3.35 | 45.68,3.66 45.51,3.5 | v45.82,3.5 45.68,3.66 | 45.68,3.35 45.51,3.5 | v45.82,3.5 45.68,3.35 | 45.68,3.66 45.51,3.5 | v45.82,3.5 45.68,3.66 | 45.95,3.66 46.12,3.5 | v45.82,3.5 45.95,3.66 | 45.95,3.35 46.12,3.5 | v45.82,3.5 45.95,3.35 | 45.95,3.66 46.12,3.5 | v45.82,3.5 45.95,3.66 | 45.95,3.35 46.12,3.5 | v45.82,3.5 45.95,3.35 | 30.89,3.65 31.06,3.5 | v30.76,3.5 30.89,3.65 | 30.89,3.35 31.06,3.5 | v30.76,3.5 30.89,3.35 | 30.89,3.65 31.06,3.5 | v30.76,3.5 30.89,3.65 | 30.89,3.35 31.06,3.5 | v30.76,3.5 30.89,3.35 | 30.89,3.65 31.06,3.5 | v30.76,3.5 30.89,3.65 | 30.89,3.35 31.06,3.5 | v30.76,3.5 30.89,3.35
  Route2 0.1: 64.35,3.36 64.2,3.53 | v64.5,3.49 64.35,3.36 | 64.38,3.66 64.2,3.53 | v64.5,3.49 64.38,3.66 | 64.7,3.51 64.72,3.28 | v64.5,3.49 64.7,3.51 | 64.49,3.29 64.72,3.28 | v64.5,3.49 64.49,3.29 | 64.35,3.36 64.2,3.53 | v64.5,3.49 64.35,3.36 | 64.38,3.66 64.2,3.53 | v64.5,3.49 64.38,3.66 | 64.35,3.36 64.2,3.53 | v64.5,3.49 64.35,3.36 | 64.38,3.66 64.2,3.53 | v64.5,3.49 64.38,3.66 | 64.7,3.51 64.72,3.28 64.49,3.29 | v64.5,3.49 64.7,3.51 | v64.5,3.49 64.49,3.29 | 64.7,3.51 64.71,3.28 64.49,3.29 | v64.5,3.49 64.7,3.51 | v64.5,3.49 64.49,3.29 | 78.47,3.34 78.31,3.5 | v78.61,3.5 78.47,3.34 | 78.47,3.65 78.31,3.5 | v78.61,3.5 78.47,3.65 | 78.47,3.34 78.31,3.5 | v78.61,3.5 78.47,3.34 | 78.47,3.65 78.31,3.5 | v78.61,3.5 78.47,3.65 | 78.47,3.34 78.31,3.5 | v78.61,3.5 78.47,3.34 | 78.47,3.65 78.31,3.5 | v78.61,3.5 78.47,3.65
  Bottom 0.1: v78.61,3.5 v78.61,3.49 81.11,3.51 82.62,3.51 83.04,3.09 84.62,3.09 85.04,3.5 87.67,3.5 | 78.75,3.65 78.92,3.5 | v78.61,3.5 78.75,3.65 | 78.75,3.34 78.92,3.5 | v78.61,3.5 78.75,3.34 | 78.75,3.65 78.92,3.5 | v78.61,3.5 78.75,3.65 | 78.75,3.34 78.92,3.5 | v78.61,3.5 78.75,3.34 | 78.75,3.65 78.92,3.5 | v78.61,3.5 78.75,3.65 | 78.75,3.34 78.92,3.5 | v78.61,3.5 78.75,3.34 | 78.75,3.65 78.92,3.5 | v78.61,3.5 78.75,3.65 | 78.75,3.34 78.92,3.5 | v78.61,3.5 78.75,3.34
  Bottom 0.102: v93.88,3.49 94.02,3.48 | 87.67,3.5 v93.88,3.49 | 93.74,3.34 93.57,3.49 | v93.88,3.49 93.74,3.34 | 93.74,3.64 93.57,3.49 | v93.88,3.49 93.74,3.64 | 93.74,3.34 93.57,3.49 | v93.88,3.49 93.74,3.34 | 93.74,3.64 93.57,3.49 | v93.88,3.49 93.74,3.64 | 93.74,3.34 93.57,3.49 | v93.88,3.49 93.74,3.34 | 93.74,3.64 93.57,3.49 | v93.88,3.49 93.74,3.64 | 93.74,3.34 93.57,3.49 | v93.88,3.49 93.74,3.34 | 93.74,3.64 93.57,3.49 | v93.88,3.49 93.74,3.64
P3_3_UCA0_MOSI_N  (via drill 0.2 pad 0.51)
  Top 0.1: v52.27,3.89 65.6,3.9 65.6,3.89 65.6,3.91 65.61,3.91 U$6.P$12 | 94.98,3.88 U$4.P$12 | v52.27,3.89 52.41,4.04 52.57,3.89 52.41,3.74 v52.27,3.89 | 47.12,3.89 U$2.P$12
  Top 0.2: v95.96,3.9 94.98,3.88 | v48,3.89 47.12,3.89 | v66.78,3.89 65.6,3.89 | 66.7,3.76 66.48,3.89 | v66.78,3.89 66.7,3.76 | 66.7,4.03 66.48,3.89 | v66.78,3.89 66.7,4.03 | 66.7,3.76 66.48,3.89 | v66.78,3.89 66.7,3.76 | 66.7,4.03 66.48,3.89 | v66.78,3.89 66.7,4.03 | 66.7,3.76 66.48,3.89 | v66.78,3.89 66.7,3.76 | 66.7,4.03 66.48,3.89 | v66.78,3.89 66.7,4.03 | 47.93,3.76 47.7,3.89 | v48,3.89 47.93,3.76 | 47.93,4.02 47.7,3.89 | v48,3.89 47.93,4.02 | 47.93,3.76 47.7,3.89 | v48,3.89 47.93,3.76 | 47.93,4.02 47.7,3.89 | v48,3.89 47.93,4.02 | 47.93,3.76 47.7,3.89 | v48,3.89 47.93,3.76 | 47.93,4.02 47.7,3.89 | v48,3.89 47.93,4.02 | v32.72,3.9 32.64,3.76 32.41,3.9 32.64,4.03 v32.72,3.9 | v80.28,3.9 80.2,3.76 79.97,3.9 80.2,4.03 v80.28,3.9 | 95.88,4.03 95.65,3.89 | v95.96,3.9 95.88,4.03 | 95.65,3.89 95.88,3.76 v95.96,3.9 | 95.88,4.03 95.65,3.89 | v95.96,3.9 95.88,4.03 | U$3.P$12 v32.72,3.9 | U$1.P$12 v80.28,3.9
  Route15 0.1: v66.78,3.89 67.86,3.9 68.68,3.9 69.08,4.3 74.65,4.29 75.05,3.9 v80.28,3.9 | v52.27,3.89 50.76,3.89 50.31,4.32 arc90 50.3,4.33 49.51,4.33 49.07,3.89 49.06,3.89 v48,3.89 | v95.96,3.9 95.81,3.9 82.93,3.9 82.52,3.5 80.96,3.5 80.51,3.9 v80.28,3.9 | v66.78,3.89 66.92,4.05 67.08,3.9 66.92,3.74 v66.78,3.89 | 52.13,4.04 51.96,3.89 | v52.27,3.89 52.13,4.04 | 51.96,3.89 52.13,3.74 v52.27,3.89 | 52.13,4.04 51.96,3.89 | v52.27,3.89 52.13,4.04 | 48.14,4.04 48.31,3.89 | v48,3.89 48.14,4.04 | 48.14,3.74 48.31,3.89 | v48,3.89 48.14,3.74 | 48.14,4.04 48.31,3.89 | v48,3.89 48.14,4.04 | 48.14,3.74 48.31,3.89 | v48,3.89 48.14,3.74 | 48.14,4.04 48.31,3.89 | v48,3.89 48.14,4.04 | 48.31,3.89 48.14,3.74 v48,3.89 | v80.28,3.9 80.44,4.02 80.58,3.84 80.38,3.72 v80.28,3.9 | v80.28,3.9 80.14,3.75 79.97,3.9 80.14,4.05 v80.28,3.9 | v95.96,3.9 95.82,3.75 95.65,3.9 95.82,4.05 v95.96,3.9
  Bottom 0.1: v32.72,3.9 32.74,3.89 35.3,3.89 35.82,3.5 40.26,3.52 40.77,3.92 v48,3.89 | 47.87,4.04 47.7,3.89 | v48,3.89 47.87,4.04 | 47.7,3.89 47.87,3.74 v48,3.89 | 47.87,4.04 47.7,3.89 | v48,3.89 47.87,4.04 | v32.72,3.9 32.85,4.05 33.02,3.89 32.85,3.74 v32.72,3.9
P3_4_UCA0_MISO_N  (via drill 0.2 pad 0.51)
  Top 0.1: v78.61,4.3 79.69,4.31 | 65.59,4.31 65.47,4.31 U$6.P$11 | U$4.P$11 94.35,4.3 94.38,4.31 94.38,4.3 | v45.38,4.3 46.51,4.3 | 78.92,4.3 78.75,4.15 v78.61,4.3 | 78.92,4.3 78.75,4.45 v78.61,4.3 | 78.92,4.3 78.75,4.15 v78.61,4.3 | 45.52,4.45 45.69,4.3 | v45.38,4.3 45.52,4.45 | 45.52,4.45 45.69,4.3 | v45.38,4.3 45.52,4.45 | 45.69,4.3 45.52,4.15 v45.38,4.3
  Top 0.2: v64.5,4.29 65.47,4.31 | v93.88,4.3 94.38,4.3 | 46.51,4.3 U$2.P$11 | v78.61,4.3 U$1.P$11 | v30.76,4.29 U$3.P$11 | 78.92,4.3 78.69,4.43 v78.61,4.3 | 78.92,4.3 78.69,4.17 v78.61,4.3 | 78.69,4.43 78.92,4.3 | v78.61,4.3 78.69,4.43 | 78.69,4.17 78.92,4.3 | v78.61,4.3 78.69,4.17 | 78.69,4.43 78.92,4.3 | v78.61,4.3 78.69,4.43 | 78.69,4.17 78.92,4.3 | v78.61,4.3 78.69,4.17 | v64.5,4.29 64.58,4.43 64.8,4.3 64.58,4.16 v64.5,4.29 | 93.96,4.43 94.18,4.3 | v93.88,4.3 93.96,4.43 | 94.18,4.3 93.96,4.17 v93.88,4.3 | 93.96,4.43 94.18,4.3 | v93.88,4.3 93.96,4.43 | 94.18,4.3 93.96,4.17 v93.88,4.3 | v30.76,4.29 30.83,4.43 31.06,4.3 30.84,4.16 v30.76,4.29
  Route2 0.1: 65.95,4.3 v64.5,4.29 | 65.95,4.3 67.44,4.3 67.89,4.71 68.69,4.71 68.7,4.7 69.1,4.3 72.48,4.29 72.85,4.7 78.16,4.7 78.21,4.7 v78.61,4.3 | 65.95,4.3 | v93.88,4.3 88.83,4.3 88.4,3.9 83.09,3.9 82.7,4.3 81.7,4.3 | v45.38,4.3 44.76,4.3 35.46,4.3 34.99,4.7 33.94,4.7 33.75,4.7 33.37,5.09 31.97,5.09 31.59,4.7 31.18,4.29 v30.76,4.29 | v45.38,4.3 46.57,4.3 47.46,3.42 47.98,3.42 48.58,3.41 49.87,4.7 51.55,4.7 51.74,4.7 52.05,5.1 63.69,5.1 63.7,5.11 | 63.7,5.11 63.69,5.11 | v64.5,4.29 63.7,5.11 | v78.61,4.3 79.09,4.29 79.1,4.3 | 78.41,4.29 78.39,4.51 | 78.62,4.5 78.39,4.51 | v78.61,4.3 78.62,4.5 | 78.75,4.45 78.92,4.3 | v78.61,4.3 78.75,4.45 | 78.75,4.15 78.92,4.3 | v78.61,4.3 78.75,4.15 | 78.41,4.29 78.39,4.51 | v78.61,4.3 78.41,4.29 | 78.62,4.5 78.39,4.51 | v78.61,4.3 78.62,4.5 | 78.41,4.29 78.4,4.51 78.62,4.5 v78.61,4.3 | v78.61,4.3 78.41,4.29 | 78.75,4.45 78.92,4.3 | v78.61,4.3 78.75,4.45 | 78.75,4.15 78.92,4.3 | v78.61,4.3 78.75,4.15 | v64.5,4.29 64.64,4.45 64.8,4.3 64.64,4.14 v64.5,4.29 | v64.5,4.29 64.3,4.29 64.29,4.51 64.51,4.5 v64.5,4.29 | v93.88,4.3 93.74,4.15 93.57,4.3 93.74,4.45 v93.88,4.3 | 30.89,4.45 31.06,4.29 | v30.76,4.29 30.89,4.45 | 30.89,4.14 31.06,4.29 | v30.76,4.29 30.89,4.14 | 31.06,4.29 30.89,4.45 v30.76,4.29 | 30.89,4.14 31.06,4.29 | v30.76,4.29 30.89,4.14 | 30.89,4.45 31.06,4.29 | v30.76,4.29 30.89,4.45 | 30.89,4.14 31.06,4.29 | v30.76,4.29 30.89,4.14 | 45.52,4.45 45.69,4.3 | v45.38,4.3 45.52,4.45 | 45.52,4.15 45.69,4.3 | v45.38,4.3 45.52,4.15 | v45.38,4.3 45.24,4.15 45.08,4.3 45.25,4.45 v45.38,4.3 | 45.69,4.3 45.52,4.45 v45.38,4.3 | 45.52,4.15 45.69,4.3 | v45.38,4.3 45.52,4.15 | 45.52,4.45 45.69,4.3 | v45.38,4.3 45.52,4.45
  Route2 0.1: 45.69,4.3 45.52,4.15 v45.38,4.3
  Route2 0.102: 81.7,4.3 79.1,4.3
P4_0_N  (via drill 0.2 pad 0.51)
  Top 0.1: U$6.P$6 65.99,6.3 v66.95,6.3 | U$1.P$6 79.6,6.3 | 79.6,6.3 79.63,6.3 | 78.81,6.3 v70.45,6.3 | v66.95,6.3 66.82,6.3 | 64.71,6.3 v63.77,6.3 | v84.71,6.3 94.09,6.3 | 79.6,6.3 | U$2.P$6 | 70.59,6.45 70.76,6.3 | v70.45,6.3 70.59,6.45 | 70.59,6.15 70.76,6.3 | v70.45,6.3 70.59,6.15 | 66.81,6.15 66.65,6.3 | v66.95,6.3 66.81,6.15 | 66.81,6.45 66.65,6.3 | v66.95,6.3 66.81,6.45 | 63.91,6.45 64.08,6.3 | v63.77,6.3 63.91,6.45 | 63.91,6.15 64.08,6.3 | v63.77,6.3 63.91,6.15 | 84.84,6.45 85.01,6.3 | v84.71,6.3 84.84,6.45 | 84.84,6.15 85.01,6.3 | v84.71,6.3 84.84,6.15 | 70.59,6.45 70.76,6.3 | v70.45,6.3 70.59,6.45 | 70.59,6.15 70.76,6.3 | v70.45,6.3 70.59,6.15 | 70.59,6.45 70.76,6.3 | v70.45,6.3 70.59,6.45 | 70.59,6.15 70.76,6.3 | v70.45,6.3 70.59,6.15 | 70.59,6.45 70.76,6.3 | v70.45,6.3 70.59,6.45 | 70.59,6.15 70.76,6.3 | v70.45,6.3 70.59,6.15 | 66.81,6.15 66.65,6.3 | v66.95,6.3 66.81,6.15 | 66.81,6.45 66.65,6.3 | v66.95,6.3 66.81,6.45 | 66.81,6.15 66.65,6.3 | v66.95,6.3 66.81,6.15 | 66.81,6.45 66.65,6.3 | v66.95,6.3 66.81,6.45 | 66.81,6.15 66.65,6.3 | v66.95,6.3 66.81,6.15 | 66.81,6.45 66.65,6.3 | v66.95,6.3 66.81,6.45 | 63.91,6.45 64.08,6.3 | v63.77,6.3 63.91,6.45 | 63.91,6.15 64.08,6.3 | v63.77,6.3 63.91,6.15 | 64.08,6.3 63.91,6.45 v63.77,6.3 | 63.91,6.15 64.08,6.3 | v63.77,6.3 63.91,6.15 | 63.91,6.45 64.08,6.3 63.91,6.15 v63.77,6.3 | v63.77,6.3 63.91,6.45 | 84.84,6.45 85.01,6.3 | v84.71,6.3 84.84,6.45 | 84.84,6.15 85.01,6.3 | v84.71,6.3 84.84,6.15 | 84.84,6.45 85.01,6.3 | v84.71,6.3 84.84,6.45 | 84.84,6.15 85.01,6.3 | v84.71,6.3 84.84,6.15 | 84.84,6.45 85.01,6.3 | v84.71,6.3 84.84,6.45 | 84.84,6.15 85.01,6.3 | v84.71,6.3 84.84,6.15
  Top 0.102: 32.11,6.3 U$3.P$6
  Top 0.2: 79.63,6.3 78.81,6.3 | v32.74,6.3 32.11,6.3 | 94.09,6.3 U$4.P$6 | v80.51,6.3 | 64.71,6.3 65.6,6.3 65.99,6.3 | 79.6,6.3 v80.51,6.3 | v45.82,6.29 U$2.P$6 | 45.9,6.43 46.13,6.29 | v45.82,6.29 45.9,6.43 | 45.9,6.16 46.13,6.29 | v45.82,6.29 45.9,6.16 | 32.66,6.17 32.43,6.3 | v32.74,6.3 32.66,6.17 | 32.66,6.43 32.43,6.3 | v32.74,6.3 32.66,6.43 | 80.43,6.17 80.21,6.3 | v80.51,6.3 80.43,6.17 | 80.43,6.43 80.21,6.3 | v80.51,6.3 80.43,6.43 | 45.9,6.43 46.13,6.29 | v45.82,6.29 45.9,6.43 | 45.9,6.16 46.13,6.29 | v45.82,6.29 45.9,6.16 | 45.9,6.43 46.13,6.29 | v45.82,6.29 45.9,6.43 | 45.9,6.16 46.13,6.29 | v45.82,6.29 45.9,6.16 | 45.9,6.43 46.13,6.29 | v45.82,6.29 45.9,6.43 | 45.9,6.16 46.13,6.29 | v45.82,6.29 45.9,6.16 | 32.66,6.17 32.43,6.3 | v32.74,6.3 32.66,6.17 | 32.66,6.43 32.43,6.3 | v32.74,6.3 32.66,6.43 | 32.66,6.17 32.43,6.3 | v32.74,6.3 32.66,6.17 | 32.66,6.43 32.43,6.3 | v32.74,6.3 32.66,6.43 | 32.66,6.17 32.43,6.3 | v32.74,6.3 32.66,6.17 | 32.66,6.43 32.43,6.3 | v32.74,6.3 32.66,6.43 | 80.43,6.17 80.21,6.3 | v80.51,6.3 80.43,6.17 | 80.43,6.43 80.21,6.3 | v80.51,6.3 80.43,6.43 | 80.43,6.17 80.21,6.3 | v80.51,6.3 80.43,6.17 | 80.43,6.43 80.21,6.3 | v80.51,6.3 80.43,6.43 | 80.43,6.17 80.21,6.3 | v80.51,6.3 80.43,6.17 | 80.43,6.43 80.21,6.3 | v80.51,6.3 80.43,6.43
  Route2 0.1: 48.58,6.29 49.01,5.9 50.18,5.9 50.57,6.29 51.21,6.29 51.73,6.3 v63.77,6.3 | 47.34,6.29 47.21,6.3 46.86,6.3 v45.82,6.29 | 34.83,6.32 35.24,5.9 36.35,5.9 40.28,5.9 40.68,6.29 40.69,6.29 v45.82,6.29 | 63.64,6.15 63.47,6.3 | v63.77,6.3 63.64,6.15 | 63.64,6.45 63.47,6.3 | v63.77,6.3 63.64,6.45 | 45.96,6.45 46.13,6.3 | v45.82,6.29 45.96,6.45 | 45.96,6.14 46.13,6.3 | v45.82,6.29 45.96,6.14 | 45.69,6.14 45.52,6.29 | v45.82,6.29 45.69,6.14 | 45.69,6.45 45.52,6.29 | v45.82,6.29 45.69,6.45 | 63.64,6.15 63.47,6.3 | v63.77,6.3 63.64,6.15 | 63.64,6.45 63.47,6.3 | v63.77,6.3 63.64,6.45 | 63.64,6.15 63.47,6.3 | v63.77,6.3 63.64,6.15 | 63.64,6.45 63.47,6.3 | v63.77,6.3 63.64,6.45 | 63.64,6.15 63.47,6.3 | v63.77,6.3 63.64,6.15 | 63.64,6.45 63.47,6.3 | v63.77,6.3 63.64,6.45 | 45.96,6.45 46.13,6.3 | v45.82,6.29 45.96,6.45 | 45.96,6.14 46.13,6.3 | v45.82,6.29 45.96,6.14 | 45.69,6.14 45.52,6.29 | v45.82,6.29 45.69,6.14 | 45.69,6.45 45.52,6.29 | v45.82,6.29 45.69,6.45 | 45.96,6.45 46.13,6.3 | v45.82,6.29 45.96,6.45 | 45.96,6.14 46.13,6.3 | v45.82,6.29 45.96,6.14 | 45.96,6.45 46.13,6.3 | v45.82,6.29 45.96,6.45 | 45.96,6.14 46.13,6.3 | v45.82,6.29 45.96,6.14 | 45.69,6.14 45.52,6.29 | v45.82,6.29 45.69,6.14 | 45.69,6.45 45.52,6.29 | v45.82,6.29 45.69,6.45 | 45.69,6.14 45.52,6.29 | v45.82,6.29 45.69,6.14 | 45.69,6.45 45.52,6.29 | v45.82,6.29 45.69,6.45
  Route2 0.102: 47.34,6.29 48.54,6.29 48.58,6.29 | 34.83,6.32 32.73,6.31 arc90 v32.74,6.3 | 32.87,6.46 33.04,6.31 | v32.74,6.3 32.87,6.46 | 32.88,6.15 33.04,6.31 | v32.74,6.3 32.88,6.15 | 32.87,6.46 33.04,6.31 | v32.74,6.3 32.87,6.46 | 32.88,6.15 33.04,6.31 | v32.74,6.3 32.88,6.15 | 32.87,6.46 33.04,6.31 | v32.74,6.3 32.87,6.46 | 32.88,6.15 33.04,6.31 | v32.74,6.3 32.88,6.15 | 32.87,6.46 33.04,6.31 | v32.74,6.3 32.87,6.46 | 32.88,6.15 33.04,6.31 | v32.74,6.3 32.88,6.15
  Bottom 0.1: v66.95,6.3 68.58,6.3 68.99,5.9 70.05,5.9 v70.45,6.3 | v84.71,6.3 84.68,6.3 82.83,6.3 82.43,5.9 81.13,5.9 80.91,5.9 v80.51,6.3 | 70.46,6.1 70.23,6.08 | v70.45,6.3 70.46,6.1 | 70.25,6.31 70.23,6.08 | v70.45,6.3 70.25,6.31 | 67.09,6.45 67.26,6.3 | v66.95,6.3 67.09,6.45 | 67.09,6.15 67.26,6.3 | v66.95,6.3 67.09,6.15 | 84.57,6.15 84.4,6.3 | v84.71,6.3 84.57,6.15 | 84.57,6.45 84.4,6.3 | v84.71,6.3 84.57,6.45 | 80.72,6.31 80.73,6.08 | v80.51,6.3 80.72,6.31 | 80.5,6.1 80.73,6.08 | v80.51,6.3 80.5,6.1 | 70.46,6.1 70.23,6.08 | v70.45,6.3 70.46,6.1 | 70.25,6.31 70.23,6.08 | v70.45,6.3 70.25,6.31 | 70.46,6.1 70.23,6.08 | v70.45,6.3 70.46,6.1 | 70.25,6.31 70.23,6.08 | v70.45,6.3 70.25,6.31 | 70.46,6.1 70.23,6.08 | v70.45,6.3 70.46,6.1 | 70.25,6.31 70.23,6.08 | v70.45,6.3 70.25,6.31 | 67.09,6.45 67.26,6.3 | v66.95,6.3 67.09,6.45 | 67.09,6.15 67.26,6.3 | v66.95,6.3 67.09,6.15 | v66.95,6.3 67.09,6.45 67.26,6.3 67.09,6.15 | v66.95,6.3 67.09,6.15 | 67.09,6.45 67.26,6.3 | v66.95,6.3 67.09,6.45 | 67.26,6.3 67.09,6.15 v66.95,6.3 | 84.57,6.15 84.4,6.3 | v84.71,6.3 84.57,6.15 | 84.57,6.45 84.4,6.3 | v84.71,6.3 84.57,6.45 | 84.57,6.15 84.4,6.3 | v84.71,6.3 84.57,6.15 | 84.57,6.45 84.4,6.3 | v84.71,6.3 84.57,6.45 | 84.57,6.15 84.4,6.3 | v84.71,6.3 84.57,6.15 | 84.57,6.45 84.4,6.3 | v84.71,6.3 84.57,6.45 | 80.72,6.31 80.73,6.08 | v80.51,6.3 80.72,6.31 | 80.5,6.1 80.73,6.08 | v80.51,6.3 80.5,6.1 | 80.72,6.31 80.73,6.08 | v80.51,6.3 80.72,6.31 | 80.5,6.1 80.73,6.08 | v80.51,6.3 80.5,6.1 | 80.72,6.31 80.73,6.08 | v80.51,6.3 80.72,6.31 | 80.73,6.08 80.5,6.1 v80.51,6.3
P4_1_UCB1_I2C_SDA_N  (via drill 0.2 pad 0.51)
  Top 0.1: 79.69,4.7 78.82,4.69 74.23,4.7 v70.45,4.7 | 84.79,4.7 U$4.P$10 94.34,4.7 | v80.44,4.7 arc90 v80.44,4.7 | 65.6,4.71 65.59,4.7 U$6.P$10 | U$2.P$10 47.1,4.69 | 70.59,4.85 70.76,4.7 | v70.45,4.7 70.59,4.85 | 70.59,4.55 70.76,4.7 | v70.45,4.7 70.59,4.55 | 84.86,4.85 85.03,4.7 | v84.72,4.7 84.86,4.85 | 84.86,4.55 85.03,4.7 | v84.72,4.7 84.86,4.55 | 70.59,4.85 70.76,4.7 | v70.45,4.7 70.59,4.85 | 70.59,4.55 70.76,4.7 | v70.45,4.7 70.59,4.55 | 70.76,4.7 70.59,4.85 v70.45,4.7 | 70.59,4.55 70.76,4.7 | v70.45,4.7 70.59,4.55 | 70.59,4.85 70.76,4.7 | v70.45,4.7 70.59,4.85 | 70.76,4.7 70.59,4.55 v70.45,4.7 | 84.86,4.85 85.03,4.7 | v84.72,4.7 84.86,4.85 | 84.86,4.55 85.03,4.7 | v84.72,4.7 84.86,4.55 | 84.86,4.85 85.03,4.7 | v84.72,4.7 84.86,4.85 | 84.86,4.55 85.03,4.7 | v84.72,4.7 84.86,4.55 | 84.86,4.85 85.03,4.7 | v84.72,4.7 84.86,4.85 | 84.86,4.55 85.03,4.7 | v84.72,4.7 84.86,4.55
  Top 0.102: 32.12,4.69 U$3.P$10